# Altium schematic sheet Sheet1.SchDoc
size A4; SheetNumber: 1; SheetTotal: 1
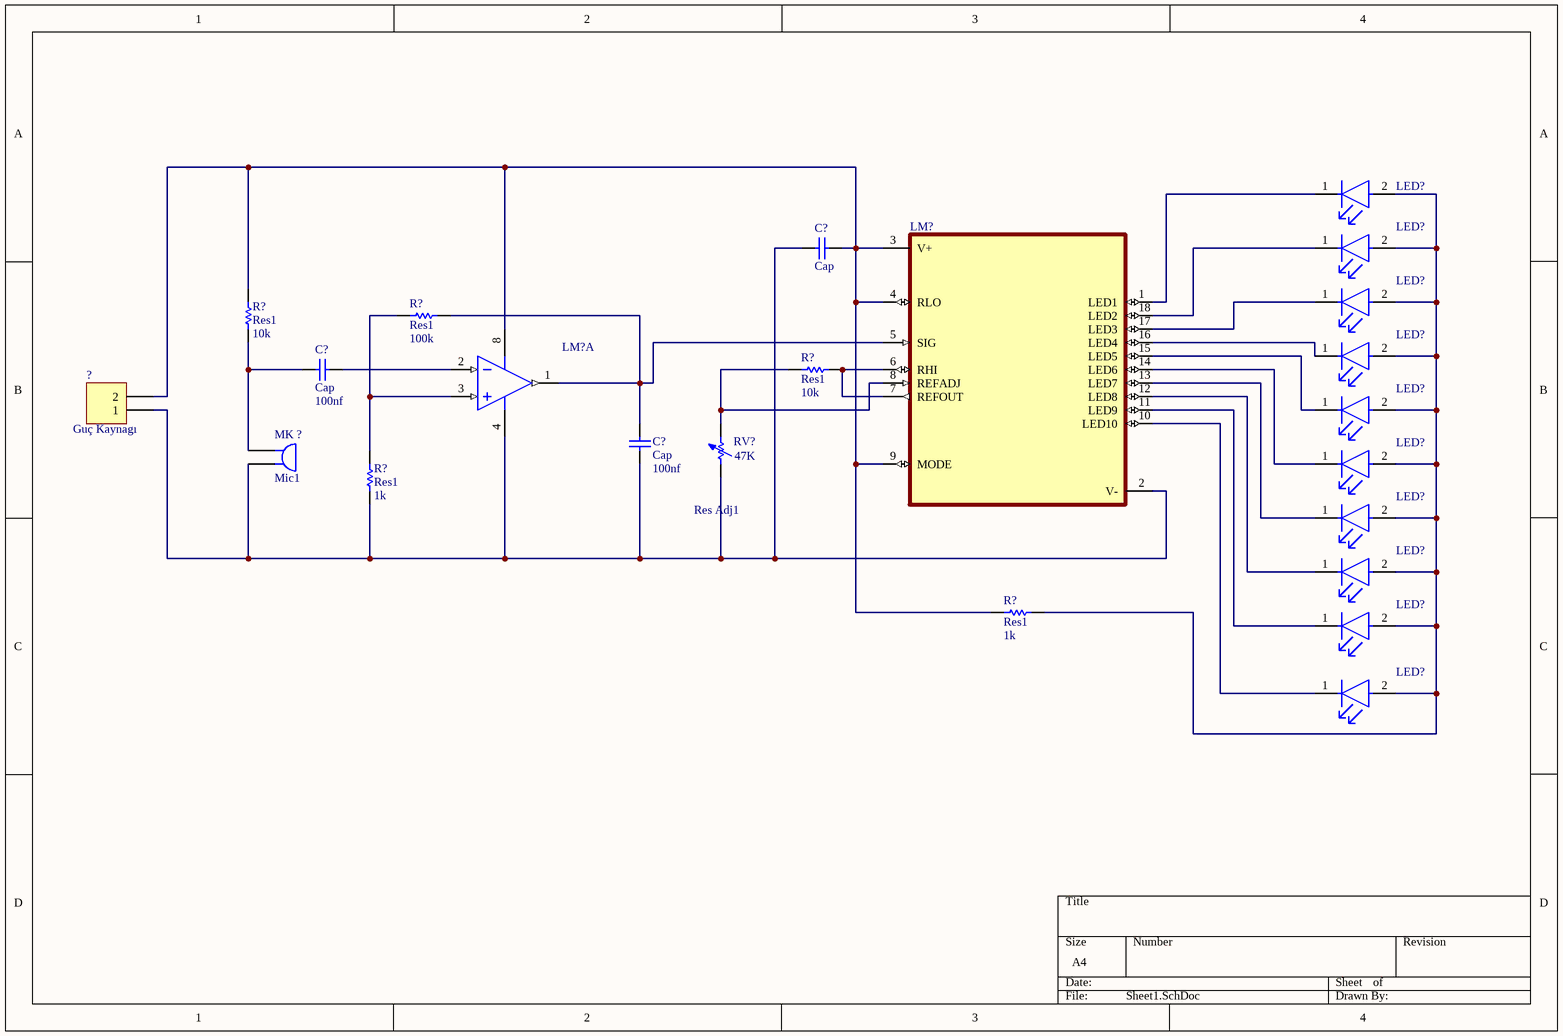
[diagram p0: Sheet1.SchDoc]

## Parts
(Parts that share a designator on the sheet are numbered #1, #2 ... from top to bottom, then left to right.)
?  Guç Kaynagı  [HDR1X2]
C?#1  Cap  [RAD-0.3]
C?#2  Cap  value 100nf  [RAD-0.3]
C?#3  Cap  value 100nf  [RAD-0.3]
LED?#1  (no value)  [FP-6_544-5259_08-4-MFG]
LED?#2  (no value)  [FP-6_544-5259_08-4-MFG]
LED?#3  (no value)  [FP-6_544-5259_08-4-MFG]
LED?#4  (no value)  [FP-6_544-5259_08-4-MFG]
LED?#5  (no value)  [FP-6_544-5259_08-4-MFG]
LED?#6  (no value)  [FP-6_544-5259_08-4-MFG]
LED?#7  (no value)  [FP-6_544-5259_08-4-MFG]
LED?#8  (no value)  [FP-6_544-5259_08-4-MFG]
LED?#9  (no value)  [FP-6_544-5259_08-4-MFG]
LED?#10  (no value)  [FP-6_544-5259_08-4-MFG]
LM?#1  (no value)  [ONSC-PDIP-8-626-05_M]  (part A of 2)
LM?#2  (no value)  [DIP952W45P254L2336H533Q18]
MK_?  Mic1  [PIN2]
R?#1  Res1  value 100k  [AXIAL-0.3]
R?#2  Res1  value 10k  [AXIAL-0.3]
R?#3  Res1  value 10k  [AXIAL-0.3]
R?#4  Res1  value 1k  [AXIAL-0.3]
R?#5  Res1  value 1k  [AXIAL-0.3]
RV?  Res Adj1  value 47K  [AXIAL-0.7]

## Nets
Net?_1: ?.1 C?#1.1 C?#3.2 LM?#1.4(VEE/GND) LM?#2.2(V-) MK_?.2 R?#4.1 RV?.1
Net?_2: ?.2 C?#1.2 LM?#1.8(VCC) LM?#2.3(V+) LM?#2.4(RLO) LM?#2.9(MODE) R?#2.2 R?#5.2
NetC?#2_1: C?#2.1 LM?#1.2(INA-)
NetC?#2_2: C?#2.2 MK_?.1 R?#2.1
NetC?#3_1: C?#3.1 LM?#1.1(OUTA) LM?#2.5(SIG) R?#1.2
NetLED?#1_1: LED?#1.1(C) LM?#2.1(LED1)
NetLED?#1_2: LED?#1.2(A) LED?#2.2(A) LED?#3.2(A) LED?#4.2(A) LED?#5.2(A) LED?#6.2(A) LED?#7.2(A) LED?#8.2(A) LED?#9.2(A) LED?#10.2(A) R?#5.1
NetLED?#2_1: LED?#2.1(C) LM?#2.18(LED2)
NetLED?#3_1: LED?#3.1(C) LM?#2.17(LED3)
NetLED?#4_1: LED?#4.1(C) LM?#2.16(LED4)
NetLED?#5_1: LED?#5.1(C) LM?#2.15(LED5)
NetLED?#6_1: LED?#6.1(C) LM?#2.14(LED6)
NetLED?#7_1: LED?#7.1(C) LM?#2.13(LED7)
NetLED?#8_1: LED?#8.1(C) LM?#2.12(LED8)
NetLED?#9_1: LED?#9.1(C) LM?#2.11(LED9)
NetLED?#10_1: LED?#10.1(C) LM?#2.10(LED10)
NetLM?#1_3: LM?#1.3(INA+) R?#1.1 R?#4.2
NetLM?#2_6: LM?#2.6(RHI) LM?#2.7(REFOUT) R?#3.1
NetLM?#2_8: LM?#2.8(REFADJ) R?#3.2 RV?.2

## Library data of the parts
? = Header 2: Header, 2-Pin; LatestRevisionDate: 17-Jul-2002; LatestRevisionNote: Re-released for DXP Platform.; Publisher: Altium Limited
C?#1-C?#3 = Cap: Capacitor; Published: 8-Jun-2000; LatestRevisionDate: 17-Jul-2002; LatestRevisionNote: Re-released for DXP Platform.; PackageReference: RAD-0.3; Publisher: Altium Limited; PackageDescription: Radial Cap, Thru-Hole; 2 Leads; 0.3 in Pin Spacing
LED?#1-LED?#10 = CMP-02520-000005-1: EMITTER IR 940NM 100MA RADIAL; Manufacturer Part Number: TSAL6100; Manufacturer: Vishay; Power Dissipation: 160mW; Forward Voltage: 1.35V; Reverse Voltage: 5V; Viewing Angle: 20°; Led Orientation: Straight; Max Junction Temp: +100°C; Colour: Infrared; RoHS: TRUE; ComponentLink2Description: Datasheet; Package: 6.544-5259.08-4; Digikey Description: EMITTER IR 940NM 100MA RADIAL; ComponentLink2URL: http://www.vishay.com/docs/81009/tsal6100.pdf; Octopart: https://octopart.com/tsal6100-vishay-39643276; Forward Current: 100mA; Peak Emmision Wavelength: 940nm; Temperature: -40°C to +85°C; Device Class L3: unset; Temperature Range Low: -40°C; Ambient Temperature Range High: +85°C; Automotive: No; Lead Free: Yes; Device Class L1: Optoelectronics; Ambient Temperature Range Low: -40°C; Category: Diode; Ipc Land Pattern Name: DIORD254W110D580H900; Device Class L2: LEDs; Temperature Range High: +85°C; Mouser Description: TSAL6100 Series 950 nm 100 mA Through Hole Infrared Emitting Diode - T-1 3/4
LM?#1 = CMP-1310-00098-1: Single Supply Dual Operational Amplifier, 3 to 32 V, 0 to 70 degC, 8-Pin PDIP, Tube; Manufacturer: On Semiconductor; PartNumber: LM358N; VCC Max (V): 32; VCC Min (V): 3; Mounting Technology: Through Hole; ComponentLink3Description: Package Specification; ComponentLink3URL: http://www.onsemi.com/pub_link/Collateral/LM211-D.PDF; RoHS: FALSE; Packing: Tube; PackageDescription: 8-Pin Plastic Dual-In Line Package, Body 9.52 x 6.605 mm, Pitch 2.54 mm; PackageReference: PDIP-8-626-05; PackageVersion: Rev. M, 04/2010; ComponentLink2Description: Datasheet; ComponentLink2URL: http://www.onsemi.cn/pub_link/Collateral/LM358-D.PDF; ComponentLink1URL: http://www.onsemi.com/; ComponentLink1Description: Manufacturer URL; DatasheetVersion: Rev. 27
LM?#2 = LM3914N-1/NOPB: None <a href="https://snapeda.com/parts/LM3914N-1/NOPB/Texas%20Instruments/view-part/?ref=eda">Check prices</a>; Price: None; MP: LM3914N-1/NOPB; Availability: Unavailable; Package: None; Value: *
MK_? = Mic1: Microphone; Published: 24-Mar-1999; LatestRevisionDate: 17-Jul-2002; LatestRevisionNote: Re-released for DXP Platform.; PackageReference: PIN2; Publisher: Altium Limited
R?#1-R?#5 = Res1: Resistor; Published: 8-Jun-2000; LatestRevisionDate: 17-Jul-2002; LatestRevisionNote: Re-released for DXP Platform.; PackageReference: AXIAL-0.3; Publisher: Altium Limited; PackageDescription: Axial Device, Thru-Hole; 2 Leads; 0.3 in Pin Spacing
RV? = Res Adj1: Variable Resistor; Set Position: 0.5; Published: 8-Jun-2000; LatestRevisionDate: 17-Jul-2002; LatestRevisionNote: Re-released for DXP Platform.; PackageReference: AXIAL-0.7; Publisher: Altium Limited; PackageDescription: Axial Device, Thru-Hole; 2 Leads; 0.7 in Pin Spacing